# EAGLE design OPA2333 break out board (EAGLE 9.4.1)
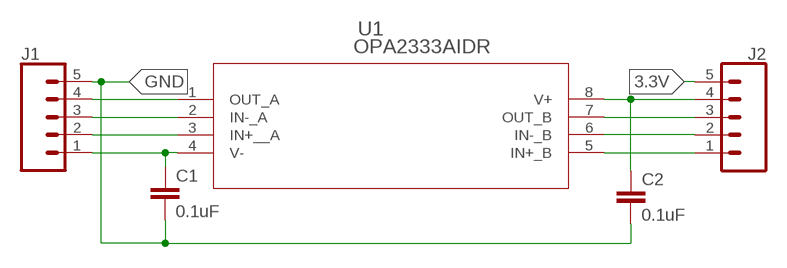
[diagram p0: schematic, sheet 1]

## Parts
C1  0.1uF  0.1UF-0603-25V-(+80/-20%)  [0603]
C2  0.1uF  0.1UF-0603-25V-(+80/-20%)  [0603]
J1  CONN_05  [1X05]
J2  CONN_05  [1X05]
U1  OPA2333AIDR  [D8]

## Nets
3.3V: J2.5
GND: C1.2 C2.2 J1.5
N$1: J1.4 U1.1(OUT_A)
N$2: J1.3 U1.2(IN-_A)
N$3: J1.2 U1.3(IN+__A)
N$4: C1.1 J1.1 U1.4(V-)
N$5: C2.1 J2.4 U1.8(V+)
N$6: J2.3 U1.7(OUT_B)
N$7: J2.2 U1.6(IN-_B)
N$8: J2.1 U1.5(IN+_B)

## Library data of the parts
C1 C2 = SparkFun-Capacitors:0.1UF: 0.1µF ceramic capacitors A capacitor is a passive two-terminal electrical component used to store electrical energy temporarily in an electric field.; PROD_ID: CAP-00810
J1 J2 = SparkFun-Connectors:CONN_05: Multi connection point. Often used as Generic Header-pin footprint for 0.1 inch spaced/style header connections On any of the 0.1 inch spaced packages, you can populate with these: Break Away Headers - Straight <https://www.sparkfun.com/products/116> (PRT-00116) Break Away Male Headers - Right Angle <https://www.sparkfun.com/products/553> (PRT-00553) Female Headers <https://www.sparkfun.com/products/115> (PRT-00115) Break Away Headers - Machine Pin <https://www.sparkfun.com/products/117> (PRT-00117) Break Away Female Headers - Swiss Machine Pin <https://www.sparkfun.com/products/743> (PRT-00743) For SCREWTERMINALS and SPRING TERMINALS visit here: Screw Terimnals on SparkFun.com <https://www.sparkfun.com/search/results?term=Screw+Terminals> (5mm/3.5mm/2.54mm spacing) This device is also useful as a general connection point to wire up your design to another part of your project. Our various solder wires solder well into these plated through hole pads. Hook-Up Wire - Assortment (Stranded, 22 AWG) <https://www.sparkfun.com/products/11375> (PRT-11375) Hook-Up Wire - Assortment (Solid Core, 22 AWG) <https://www.sparkfun.com/products/11367> (PRT-11367) View the entire wire category on our website here <https://www.sparkfun.com/categories/141> Special notes: Molex polarized connector foot print use with SKU : PRT-08231 with associated crimp pins and housings. 1MM SMD Version SKU: PRT-10208
U1 = OPA2333AIDR:OPA2333AIDR; MANUFACTURER_PART_NUMBER: OPA2333AIDR; VENDOR: Texas Instruments

## Board
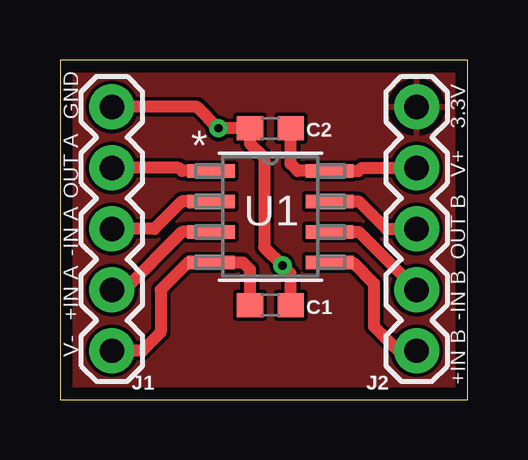
[diagram p1: board, top side]
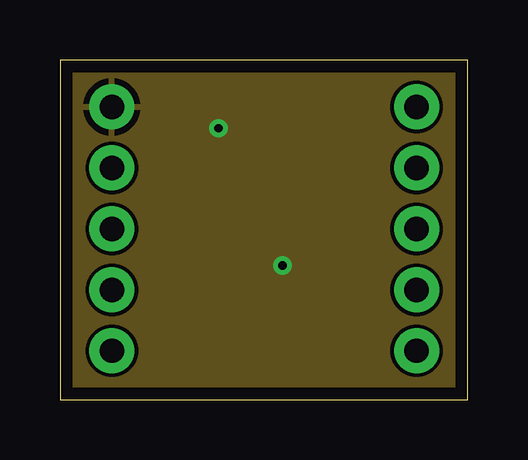
[diagram p2: board, inner layer Route2]
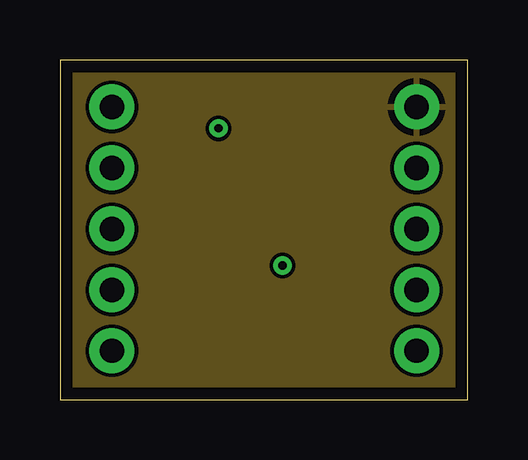
[diagram p3: board, inner layer Route15]
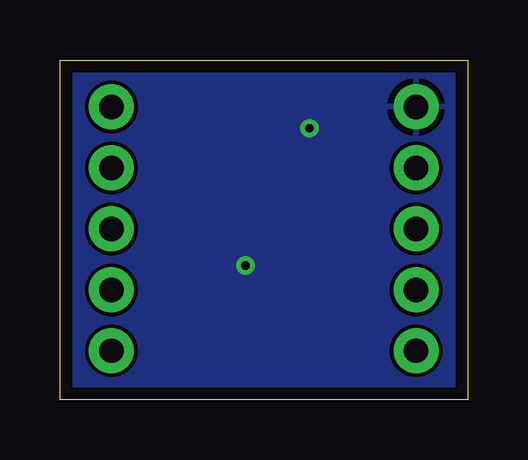
[diagram p4: board, bottom side, seen from below]

Size 17 x 14.15 mm. Coordinates in mm from the lower left corner, seen from the top.
Outline: 0,0 17,0 17,14.15 0,14.15 0,0
Copper layers (1+2*15+16): Top 0.0178mm / dielectric 12mil / Route2 0.0356mm / dielectric 28mil / Route15 0.0356mm / dielectric 12mil / Bottom 0.0178mm
Design rules "SSC-EAGLE-4Lyr_v1.0.0.3": minimum track width 6mil, minimum drill 8mil, track to track 6mil, track to pad 6mil, pad to pad 6mil, via to via 6mil, smd to smd 6mil, copper to edge 20mil, drill to drill 16mil, minimum pad ring 8mil, minimum via ring 8mil, stop-mask expansion 3mil, vias tented up to drill 0mil, thermal gap 10mil

### Footprints (pad centres in the part's own frame; a part is rotated, then mirrored left to right if it is on the bottom)
0603 = smd 1.1 x 1: 1 -0.85,0; 2 0.85,0
1X05 = drill 1.016 pad 1.88: 1 0,0; 2 2.54,0; 3 5.08,0; 4 7.62,0; 5 10.16,0
D8 = smd 1.981 x 0.559: 1 -2.464,1.905; 2 -2.464,0.635; 3 -2.464,-0.635; 4 -2.464,-1.905; 5 2.464,-1.905; 6 2.464,-0.635; 7 2.464,0.635; 8 2.464,1.905

### Placement (x,y rotation side)
C1  8.76,3.94 0 top
C2  8.76,11.3 180 top
J1  2.16,2.03 90 top
J2  14.86,2.03 90 top
U1  8.76,7.62 0 top

### Tracks (layer width: path | path; a pad name or v marks a point on that pad's centre or on a via)
3.3V
  pour Top: 0,14.22 17.02,14.22 17.02,0 0,0
  pour Route15: 0,14.22 17.02,14.22 17.02,0 0,0
GND  (via drill 0.35)
  Top 0.508: J1.5 5.71,12.19 v6.6,11.3 C2.2 7.91,10.67 8.51,10.07 8.51,6.35 v9.27,5.59 9.61,5.25 C1.2
  pour Route2: 0,0 0,14.22 17.02,14.22 17.02,-0.25 0.25,-0.25
  pour Bottom: 0,14.22 17.02,14.22 17.02,0 0,0
N$1
  Top 0.508: U1.1 5.08,9.53 4.95,9.65 J1.4
N$2
  Top 0.508: U1.2 5.08,8.26 3.94,7.11 J1.3
N$3
  Top 0.508: U1.3 5.08,6.99 2.67,4.57 J1.2
N$4
  Top 0.508: J1.1 3.43,2.03 4.19,2.79 4.19,4.57 5.33,5.71 U1.4 7.62,5.71 7.91,5.42 C1.1
N$5
  Top 0.508: J2.4 12.57,9.65 12.45,9.53 U1.8 9.91,9.53 9.61,9.82 C2.1
N$6
  Top 0.508: U1.7 12.45,8.26 13.59,7.11 J2.3
N$7
  Top 0.508: U1.6 12.45,6.99 J2.2
N$8
  Top 0.508: U1.5 12.19,5.71 13.08,4.83 13.08,3.05 14.1,2.03 J2.1

### Text on the board
tNames: GND | 3.3V | V+ | OUT A | -IN A | OUT B | +IN A | -IN B | V- | +IN B